# Altium schematic sheet [05] - ENERGY STORAGE AND PROTECTION.SchDoc
size A4; DocumentNumber: 5; SheetNumber: 5; SheetTotal: 12; PageSetup: Record=PageOptions|CenterHorizontal=True|CenterVertical=True|PrintScale=0.73|XCorrection=1.00|YCorrection=1.00|PrintKind=0|BorderSize=5000000|LeftOffset=0|BottomOffset=0|Orientation=2|PaperLength=1000|PaperWidth=1000|Scale=100|PaperSource=7|PrintQuality=-3|MediaType=1|DitherType=10|PrintScaleMode=1|PaperKind=A3|PaperIndex=8
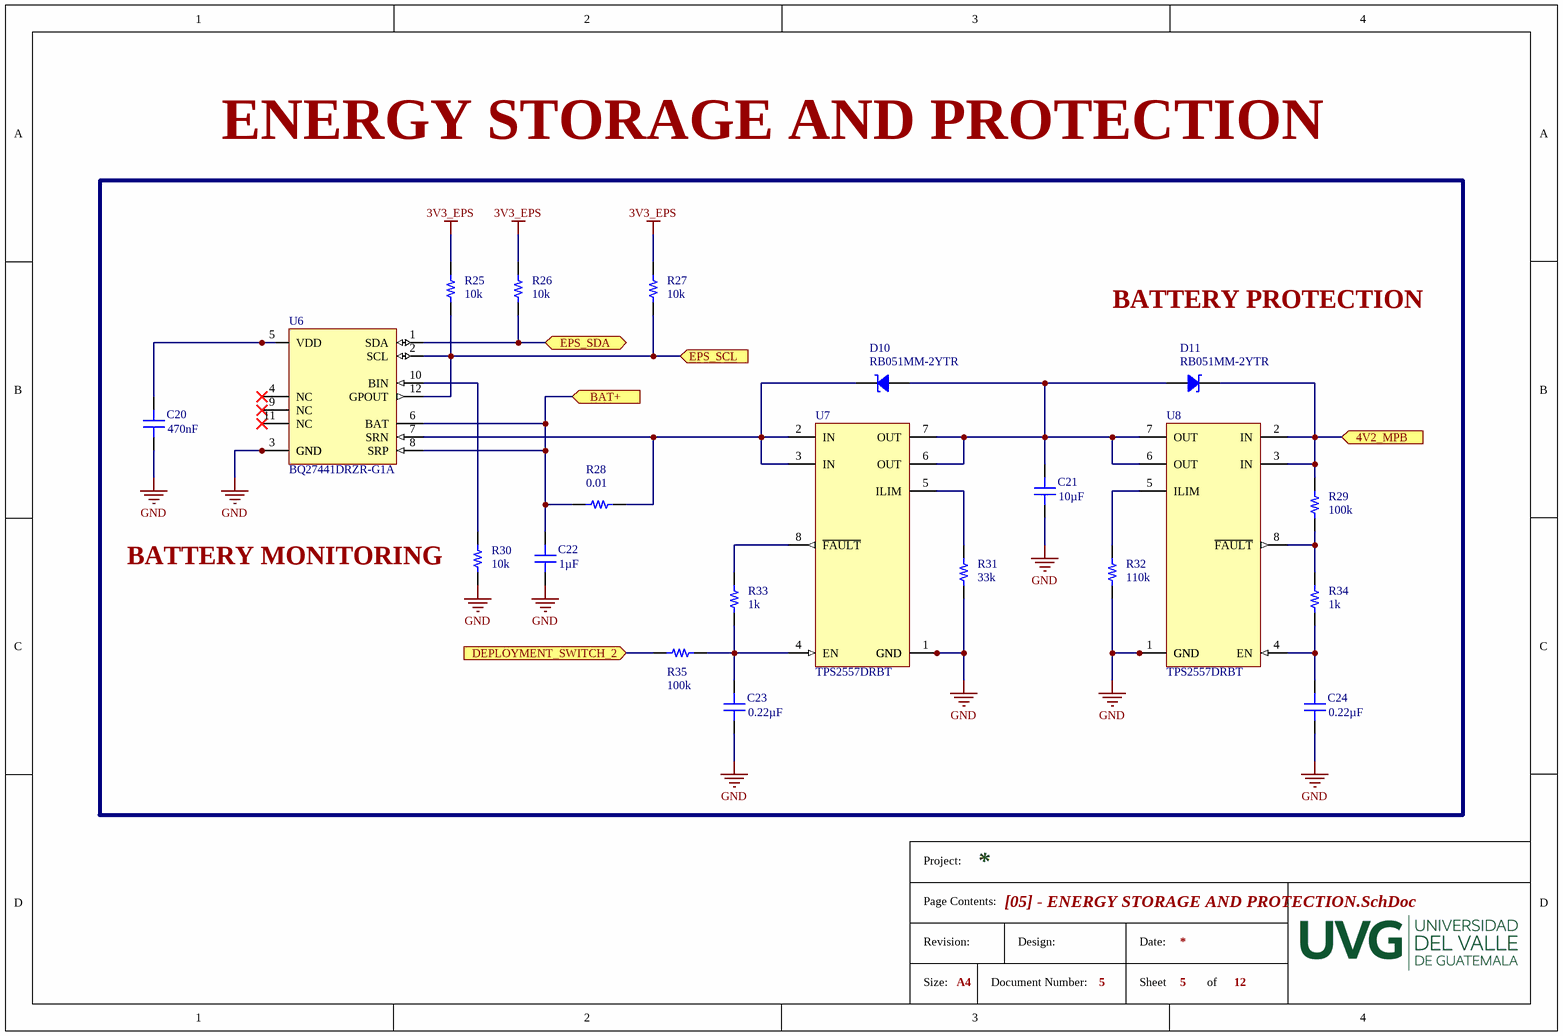
[diagram p0: [05] - ENERGY STORAGE AND PROTECTION.SchDoc]

## Parts
C20  Capacitance: 470nF  [RES 0603/1608]  (hidden comment: CL10B474KA8NFNC)
C21  Capacitance: 10µF  [CAP 0603/1608]  (hidden comment: CL10A106MQ8NNNC)
C22  Capacitance: 1µF  [CAP 0603/1608]  (hidden comment: CL10A105KP8NNNC)
C23  EMK107B7224KA-T  [CAP 0603/1608]  (value not drawn)
C24  EMK107B7224KA-T  [CAP 0603/1608]  (value not drawn)
D10  RB051MM-2YTR  [SOD123F]
D11  RB051MM-2YTR  [SOD123F]
R25  Resistance: 10k  [RES 0603/1608]  (hidden comment: RNCP0603FTD10K0)
R26  Resistance: 10k  [RES 0603/1608]  (hidden comment: RNCP0603FTD10K0)
R27  Resistance: 10k  [RES 0603/1608]  (hidden comment: RNCP0603FTD10K0)
R28  Resistance: 0.01  [STACKPOLE CSR2010]  (hidden comment: CSRN2010FK10L0)
R29  Resistance: 100k  [RES 0603/1608]  (hidden comment: CR0603-JW-104ELF)
R30  Resistance: 10k  [RES 0603/1608]  (hidden comment: RNCP0603FTD10K0)
R31  CRGCQ0603F33K  [RES 0603/1608]  (value not drawn)
R32  Resistance: 110k  [RES 0603/1608]  (hidden comment: RC0603FR-07110KL)
R33  Resistance: 1k  [RES 0603/1608]  (hidden comment: ESR03EZPJ102)
R34  Resistance: 1k  [RES 0603/1608]  (hidden comment: ESR03EZPJ102)
R35  Resistance: 100k  [RES 0603/1608]  (hidden comment: CR0603-JW-104ELF)
U6  BQ27441DRZR-G1A  [12-VFDFN]
U7  TPS2557DRBT  [8-VDFN]
U8  TPS2557DRBT  [8-VDFN]

## Ports
4V2_MPB (in), BAT+ (in), DEPLOYMENT_SWITCH_2 (in), EPS_SCL (in), EPS_SDA (bidir)

## Nets
3V3_EPS: R25.2 R26.2 R27.2
GND: C20.1 C21.1 C22.1 C23.1 C24.1 R30.1 R31.1 R32.1 U6.3(GND) U6.13(GND) U7.1(GND) U7.9(GND) U8.1(GND) U8.9(GND)
4V2_MPB: D11.2 R29.2 U8.2(IN) U8.3(IN) ; port 4V2_MPB
BAT+: C22.2 R28.2 U6.6(BAT) U6.8(SRP) ; port BAT+
DEPLOYMENT_SWITCH_2: R35.1 ; port DEPLOYMENT_SWITCH_2
EPS_SCL: R25.1 R27.1 U6.2(SCL) U6.12(GPOUT) ; port EPS_SCL
EPS_SDA: R26.1 U6.1(SDA) ; port EPS_SDA
NetC20_2: C20.2 U6.5(VDD)
NetC21_2: C21.2 D10.1 D11.1 U7.6(OUT) U7.7(OUT) U8.6(OUT) U8.7(OUT)
NetC23_2: C23.2 R33.1 R35.2 U7.4(EN)
NetC24_2: C24.2 R34.1 U8.4(EN)
NetD10_2: D10.2 R28.1 U6.7(SRN) U7.2(IN) U7.3(IN)
NetR29_1: R29.1 R34.2 U8.8(~{FAULT})
NetR30_2: R30.2 U6.10(BIN)
NetR31_2: R31.2 U7.5(ILIM)
NetR32_2: R32.2 U8.5(ILIM)
NetR33_2: R33.2 U7.8(~{FAULT})

Not connected (* = marked no-connect by the designer): U6 4(NC)* 9(NC)* 11(NC)*

## Notes on the sheet
- ENERGY STORAGE AND PROTECTION
- BATTERY PROTECTION
- BATTERY MONITORING
- (near R31) 33k
- (near C23) 0.22µF
- (near C24) 0.22µF
- Project:
- Page Contents:
- Size:
- Revision:
- A4
- Document Number:
- Design:
- Date:
- Sheet
- of

## Library data of the parts
C20 = CL10B474KA8NFNC: CAP CER 0.47UF 25V X7R 0603; Manufacturer: Samsung; Tolerance: 10%; Supplier 1: Digi-Key; Manufacturer Part Number: CL10B474KA8NFNC; Stock 1: 469116; Pricing 1: 1 = 0.10000, 10 = 0.07300, 100 = 0.03450, 500 = 0.02422, 1000 = 0.02005 (USD); RoHS: Yes; Mount: Surface Mount; Case/Package: 0603; Case Code (Metric): 1608; Case Code (Imperial): 0603; Min Operating Temperature: -55°C; Max Operating Temperature: 125°C; Package Quantity: 1; Packaging: Tape and Reel; Voltage Rating: 25V; Dielectric: X7R; Length: 0.063inch; Height: 0.8mm; Width: 0.031inch; Thickness: 0.035inch; Depth: 0.8mm; Radiation Hardening: No; Lead Free: Lead Free; ComponentLink1URL: https://datasheet.ciiva.com/25777/cl10b474ka8nfnc-25777510.pdf?src-supplier=Digi-Key; ComponentLink1Description: https://datasheet.ciiva.com/25777/cl10b474ka8nfnc-25777510.pdf?src-supplier=Digi-Key; ComponentLink2URL: https://datasheet.ciiva.com/16428/cl10b474ka8nfnc-16428839.pdf?src-supplier=Future+Electronics; ComponentLink2Description: https://datasheet.ciiva.com/16428/cl10b474ka8nfnc-16428839.pdf?src-supplier=Future+Electronics; Supplier Part Number 1: 1276-2082-1-ND
C21 = CL10A106MQ8NNNC: CAP CER 10UF 6.3V X5R 0603; Manufacturer: Samsung; Tolerance: 20%; Supplier 1: Digi-Key; Manufacturer Part Number: CL10A106MQ8NNNC; Stock 1: 3866590; Pricing 1: 1 = 0.15000, 10 = 0.11000, 100 = 0.05150, 500 = 0.03614, 1000 = 0.02992 (USD); RoHS: Yes; Mount: Surface Mount; Case/Package: 0603; Case Code (Metric): 1608; Case Code (Imperial): 0603; Contact Plating: Tin; Min Operating Temperature: -55°C; Max Operating Temperature: 85°C; Package Quantity: 1; Packaging: Tape and Reel; Voltage Rating: 6.3V; Dielectric: X5R; Voltage: 6.3V; Length: 1.6mm; Height: 0.8mm; Width: 0.031inch; Thickness: 0.035inch; Depth: 0.8mm; Radiation Hardening: No; ComponentLink1URL: https://datasheet.ciiva.com/25798/cl10a106mq8nnnc-25798320.pdf?src-supplier=Digi-Key; ComponentLink1Description: https://datasheet.ciiva.com/25798/cl10a106mq8nnnc-25798320.pdf?src-supplier=Digi-Key; ComponentLink2URL: https://datasheet.ciiva.com/26838/getdatasheetpartid-357557-26838347.pdf?src-supplier=Verical; ComponentLink2Description: https://datasheet.ciiva.com/26838/getdatasheetpartid-357557-26838347.pdf?src-supplier=Verical; ComponentLink3URL: https://datasheet.ciiva.com/16437/cl05b104kq5nnnc-16437327.pdf?src-supplier=Future+Electronics; ComponentLink3Description: https://datasheet.ciiva.com/16437/cl05b104kq5nnnc-16437327.pdf?src-supplier=Future+Electronics; Supplier Part Number 1: 1276-1119-1-ND
C22 = CL10A105KP8NNNC: CAP CER 1UF 10V X5R 0603; Manufacturer: Samsung; Tolerance: 10%; Supplier 1: Digi-Key; Manufacturer Part Number: CL10A105KP8NNNC; Stock 1: 4411775; Pricing 1: 1 = 0.10000, 10 = 0.03800, 100 = 0.01680, 500 = 0.01200, 1000 = 0.00943 (USD); RoHS: Yes; Mount: Surface Mount; Case/Package: 0603; Case Code (Metric): 1608; Case Code (Imperial): 0603; Contact Plating: Tin; Min Operating Temperature: -55°C; Max Operating Temperature: 85°C; Packaging: Tape and Reel; Package Quantity: 1; Voltage Rating: 10V; Dielectric: X5R; Voltage: 10V; Length: 1.6mm; Height: 0.8mm; Width: 0.031inch; Thickness: 0.035inch; Depth: 0.8mm; Radiation Hardening: No; ComponentLink1URL: https://datasheet.ciiva.com/15195/getdatasheetpartid-358616-15195708.pdf?src-supplier=Verical; ComponentLink1Description: https://datasheet.ciiva.com/15195/getdatasheetpartid-358616-15195708.pdf?src-supplier=Verical; ComponentLink2URL: https://datasheet.ciiva.com/16358/cl05b104kq5nnnc-16358431.pdf?src-supplier=Future+Electronics; ComponentLink2Description: https://datasheet.ciiva.com/16358/cl05b104kq5nnnc-16358431.pdf?src-supplier=Future+Electronics; Supplier Part Number 1: 1276-1182-1-ND
C23 C24 = EMK107B7224KA-T: CAP CER 0.22UF 16V X7R 0603
D10 D11 = RB051MM-2YTR: DIODE SCHOTTKY 20V 3A PMDU; Manufacturer: Rohm; Supplier 1: Digi-Key; Manufacturer Part Number: RB051MM-2YTR; Stock 1: 1333; Pricing 1: 1 = 0.49000, 10 = 0.41700, 100 = 0.31150, 500 = 0.24472, 1000 = 0.18911 (USD); Mount: Surface Mount; Packaging: Tape and Reel; Average Rectified Current: 3A; Max Reverse Voltage (DC): 20V; ComponentLink1URL: http://www.mouser.com/ds/2/348/rb051mm-2y-e-1017157.pdf?src-supplier=Mouser; ComponentLink1Description: http://www.mouser.com/ds/2/348/rb051mm-2y-e-1017157.pdf?src-supplier=Mouser; ComponentLink2URL: http://www.rohm.com/web/global/datasheet/RB051MM-2Y/rb051mm-2y-e?src-supplier=Digi-Key; ComponentLink2Description: http://www.rohm.com/web/global/datasheet/RB051MM-2Y/rb051mm-2y-e?src-supplier=Digi-Key; ComponentLink3URL: http://rohmfs.rohm.com/en/techdata_basic/diode/taping/Taping_PMDU(M)_TR-e.pdf?src-supplier=Digi-Key; ComponentLink3Description: http://rohmfs.rohm.com/en/techdata_basic/diode/taping/Taping_PMDU(M)_TR-e.pdf?src-supplier=Digi-Key; Supplier Part Number 1: RB051MM-2YCT-ND
R25-R27 R30 = RNCP0603FTD10K0: RES SMD 10K OHM 1% 1/8W 0603; Manufacturer: Stackpole Electronics; Max Power Dissipation: 125mW; Temperature Coefficient: 100ppm/°C; Supplier 1: Digi-Key; Manufacturer Part Number: RNCP0603FTD10K0; Stock 1: 579582; Pricing 1: 1 = 0.10000, 10 = 0.06700, 100 = 0.02730, 1000 = 0.01224, 2500 = 0.01063 (USD); RoHS: Yes; Mount: Surface Mount; Case/Package: 0603; Case Code (Metric): 1608; Case Code (Imperial): 0603; Contact Plating: Tin; Min Operating Temperature: -55°C; Max Operating Temperature: 155°C; Packaging: Tape and Reel; Tolerance: 1%; Composition: Thin Film; Number of Terminations: 2; Features: Moisture Resistant; Length: 0.059inch; Height: 0.02inch; Width: 0.031inch; Radiation Hardening: No; Lead Free: Lead Free; ComponentLink1URL: https://www.seielect.com/Catalog/SEI-rncp.pdf?src-supplier=Avnet; ComponentLink1Description: https://www.seielect.com/Catalog/SEI-rncp.pdf?src-supplier=Avnet; ComponentLink2URL: https://www.seielect.com/catalog/SEI-Packaging.pdf?src-supplier=Digi-Key; ComponentLink2Description: https://www.seielect.com/catalog/SEI-Packaging.pdf?src-supplier=Digi-Key; ComponentLink3URL: https://www.seielect.com/Catalog/SEI-rncp.pdf?src-supplier=Digi-Key; ComponentLink3Description: https://www.seielect.com/Catalog/SEI-rncp.pdf?src-supplier=Digi-Key; Supplier Part Number 1: RNCP0603FTD10K0CT-ND
R28 = CSRN2010FK10L0: RES 0.01 OHM 1% 1W 2010; Manufacturer: Stackpole Electronics; Temperature Coefficient: 250ppm/°C; Supplier 1: Digi-Key; Manufacturer Part Number: CSRN2010FK10L0; Stock 1: 15344; Pricing 1: 1=0.58, 10=0.485, 25=0.416, 50=0.3742, 100=0.3257, 250=0.29108, 500=0.23562 (USD); Mount: Surface Mount; Case/Package: 2010; Case Code (Metric): 5025; Case Code (Imperial): 2010; Contact Plating: Matte,Tin; Min Operating Temperature: -55°C; Max Operating Temperature: 155°C; Packaging: Tape and Reel; Tolerance: 1%; Power Rating: 1W; Composition: Thick Film; Number of Terminations: 2; Max Power Dissipation: 1W; Length: 0.197inch; Height: 0.03inch; Width: 0.097inch; Radiation Hardening: No; Supplier Part Number 1: CSRN2010FK10L0DKR-ND
R29 R35 = CR0603-JW-104ELF: RES SMD 100K OHM 5% 1/10W 0603; Manufacturer: Bourns; Power Rating: 100mW; Voltage Rating: 50V; Temperature Coefficient: 200ppm/°C; Supplier 1: Digi-Key; Manufacturer Part Number: CR0603-JW-104ELF; Stock 1: 138181; Pricing 1: 1 = 0.10000, 10 = 0.01500, 25 = 0.01080, 50 = 0.00840, 100 = 0.00610, 250 = 0.00468, 500 = 0.00374, 1000 = 0.00275 (USD); RoHS: Yes; Mount: Surface Mount; Case/Package: 0603; Number of Pins: 2; Case Code (Imperial): 0603; Case Code (Metric): 1608; Contact Plating: Tin; Min Operating Temperature: -55°C; Max Operating Temperature: 155°C; Packaging: Tape and Reel; Tolerance: 5%; Package Quantity: 5000; Composition: Thick Film; Termination: SMD/SMT; Working Voltage: 50V; Military Standard: Not; Voltage Rating (DC): 50V; Length: 1.6mm; Height: 0.45mm; Width: 0.8mm; Depth: 0.8mm; Thickness: 457um; Radiation Hardening: No; REACH SVHC: No SVHC; ComponentLink1URL: https://datasheet.ciiva.com/22713/691949-22713239.pdf?src-supplier=Element14; ComponentLink1Description: https://datasheet.ciiva.com/22713/691949-22713239.pdf?src-supplier=Element14; ComponentLink2URL: https://datasheet.ciiva.com/23776/1902866-23776391.pdf?src-supplier=Newark; ComponentLink2Description: https://datasheet.ciiva.com/23776/1902866-23776391.pdf?src-supplier=Newark; ComponentLink3URL: https://datasheet.ciiva.com/16766/70154685-16766760.pdf?src-supplier=Allied+Electronics; ComponentLink3Description: https://datasheet.ciiva.com/16766/70154685-16766760.pdf?src-supplier=Allied+Electronics; ComponentLink4URL: https://datasheet.ciiva.com/30229/159chpreztr-30229129.pdf?src-supplier=Onlinecomponents.com; ComponentLink4Description: https://datasheet.ciiva.com/30229/159chpreztr-30229129.pdf?src-supplier=Onlinecomponents.com; ComponentLink5URL: https://datasheet.ciiva.com/16935/chpreztr-16935963.pdf?src-supplier=Avnet+Europe; ComponentLink5Description: https://datasheet.ciiva.com/16935/chpreztr-16935963.pdf?src-supplier=Avnet+Europe; ComponentLink6URL: https://datasheet.ciiva.com/5543/chpreztr-5543676.pdf?src-supplier=Mouser; ComponentLink6Description: https://datasheet.ciiva.com/5543/chpreztr-5543676.pdf?src-supplier=Mouser; ComponentLink7URL: https://datasheet.ciiva.com/9120/chpreztr-9120764.pdf?src-supplier=Avnet; ComponentLink7Description: https://datasheet.ciiva.com/9120/chpreztr-9120764.pdf?src-supplier=Avnet; ComponentLink8URL: https://datasheet.ciiva.com/46383/1791942-46383790.pdf?src-supplier=Element14; ComponentLink8Description: https://datasheet.ciiva.com/46383/1791942-46383790.pdf?src-supplier=Element14; ComponentLink9URL: https://datasheet.ciiva.com/48692/001055501-da-01-en-smd-wid-cr0603-jw-104elf-100k-ohm-1-10w-48692133.pdf?src-supplier=Conrad; ComponentLink9Description: https://datasheet.ciiva.com/48692/001055501-da-01-en-smd-wid-cr0603-jw-104elf-100k-ohm-1-10w-48692133.pdf?src-supplier=Conrad; Supplier Part Number 1: CR0603-JW-104ELFCT-ND
R31 = CRGCQ0603F33K: RES SMD 33K OHM 1% 1/10W 0603; Manufacturer: TE Connectivity; Supplier 1: Digi-Key; Manufacturer Part Number: CRGCQ0603F33K; Stock 1: 142729; Pricing 1: 1 = 0.10000, 10 = 0.03100, 100 = 0.01260, 1000 = 0.00568, 2500 = 0.00493 (USD); ComponentLink1URL: http://sigma.octopart.com/114683329/technical_drawing/TE-Connectivity-CRGCQ0603F33K.pdf?src-supplier=TE+Connectivity; ComponentLink1Description: http://sigma.octopart.com/114683329/technical_drawing/TE-Connectivity-CRGCQ0603F33K.pdf?src-supplier=TE+Connectivity; ComponentLink2URL: http://datasheet.octopart.com/CRGCQ0603F33K-TE-Connectivity-datasheet-114679081.pdf?src-supplier=TE+Connectivity; ComponentLink2Description: http://datasheet.octopart.com/CRGCQ0603F33K-TE-Connectivity-datasheet-114679081.pdf?src-supplier=TE+Connectivity; Supplier Part Number 1: A129706CT-ND
R32 = RC0603FR-07110KL: RES SMD 110K OHM 1% 1/10W 0603; Manufacturer: Yageo; Power Rating: 100mW; Voltage Rating: 50V; Temperature Coefficient: 100ppm/°C; Supplier 1: Digi-Key; Manufacturer Part Number: RC0603FR-07110KL; Stock 1: 1846762; Pricing 1: 1=0.1, 10=0.024, 100=0.0097, 1000=0.00437, 2500=0.00379 (USD); Mount: Surface Mount; Case/Package: 0603; Case Code (Metric): 1608; Case Code (Imperial): 0603; Min Operating Temperature: -55°C; Max Operating Temperature: 155°C; Tolerance: 1%; Package Quantity: 1; Packaging: Tape and Reel; Composition: Thick Film; Number of Terminations: 2; Termination: SMD/SMT; Military Standard: Not; Max Power Dissipation: 100mW; Voltage Rating (DC): 50V; Features: Moisture Resistant; Length: 1.6mm; Height: 0.022inch; Width: 0.031inch; Depth: 0.8mm; Lead Free: Lead Free; ComponentLink1URL: http://documents.rs-components.com/techlib://itc_doclist_GB.htm?stockno=5049117&src-supplier=RSComponents; ComponentLink1Description: http://documents.rs-components.com/techlib://itc_doclist_GB.htm?stockno=5049117&src-supplier=RSComponents; ComponentLink2URL: http://www.yageo.com/documents/recent/PYu-RC_Group_51_RoHS_L_10.pdf?src-supplier=Digi-Key; ComponentLink2Description: http://www.yageo.com/documents/recent/PYu-RC_Group_51_RoHS_L_10.pdf?src-supplier=Digi-Key; ComponentLink3URL: https://www.verical.com/server-webapp/html/getDatasheet?partID=324995&src-supplier=Verical; ComponentLink3Description: https://www.verical.com/server-webapp/html/getDatasheet?partID=324995&src-supplier=Verical; ComponentLink4URL: http://www.yageo.com/documents/recent/PYu-RC_Group_51_RoHS_L_9.pdf?src-supplier=Digi-Key; ComponentLink4Description: http://www.yageo.com/documents/recent/PYu-RC_Group_51_RoHS_L_9.pdf?src-supplier=Digi-Key; Supplier Part Number 1: 311-110KHRCT-ND
R33 R34 = ESR03EZPJ102: RES SMD 1K OHM 5% 1/4W 0603; Manufacturer: Rohm; Temperature Coefficient: 200ppm/°C; Max Power Dissipation: 250mW; Supplier 1: Digi-Key; Manufacturer Part Number: ESR03EZPJ102; Stock 1: 187581; Pricing 1: 1 = 0.10000, 10 = 0.08300, 100 = 0.03180, 1000 = 0.01398, 2500 = 0.01207 (USD); RoHS: Yes; Case/Package: 0603; Case Code (Metric): 1608; Case Code (Imperial): 0603; Min Operating Temperature: -55°C; Max Operating Temperature: 155°C; Tolerance: 5%; Package Quantity: 1; Packaging: Tape and Reel; Composition: Thick Film; Number of Terminations: 2; Features: Automotive AEC-Q200; Length: 0.063inch; Height: 0.022inch; Width: 0.031inch; Lead Free: Lead Free; ComponentLink1URL: https://datasheet.ciiva.com/2469/esr-2469603.pdf?src-supplier=Digi-Key; ComponentLink1Description: https://datasheet.ciiva.com/2469/esr-2469603.pdf?src-supplier=Digi-Key; ComponentLink2URL: https://datasheet.ciiva.com/2469/esr-2469604.pdf?src-supplier=Digi-Key; ComponentLink2Description: https://datasheet.ciiva.com/2469/esr-2469604.pdf?src-supplier=Digi-Key; ComponentLink3URL: https://datasheet.ciiva.com/2469/esr-2469605.pdf?src-supplier=Digi-Key; ComponentLink3Description: https://datasheet.ciiva.com/2469/esr-2469605.pdf?src-supplier=Digi-Key; Supplier Part Number 1: RHM1.0KDCT-ND
U6 = BQ27441DRZR-G1A: IC BATT FUEL GAUGE LI-ION 12SON; Manufacturer: Texas Instruments; Number of Cells: 1; Interface: I2C; Capacity: 8000mAh; Output Voltage: 600mV; Output Current: 500uA; Operating Supply Voltage: 4.5V; Supplier 1: Digi-Key; Manufacturer Part Number: BQ27441DRZR-G1A; Stock 1: 11262; Pricing 1: 1=2.62, 10=2.353, 100=1.8911, 500=1.55376, 1000=1.2874 (USD); Mount: Surface Mount; Case/Package: QFN; Number of Pins: 12; Contact Plating: Gold; Min Operating Temperature: -40°C; Max Operating Temperature: 85°C; Package Quantity: 3000; Packaging: Tape and Reel; Lead Free: Lead Free; Supplier Part Number 1: 296-39941-6-ND
U7 U8 = TPS2557DRBT: IC PWR DIST SWITCH ADJ 8SON; Manufacturer: Texas Instruments; Number of Inputs: 1; Max Output Current: 5A; Max Input Voltage: 6.5V; Min Input Voltage: 2.5V; Interface: On/Off; On-State Resistance: 22mR; Turn-Off Delay Time: 6ms; Turn-On Delay Time: 9ms; Power Rating: 2.403W; Power Dissipation: 2.4W; Fault Protection: Over Temperature; Output Configuration: High Side; Supplier 1: Digi-Key; Manufacturer Part Number: TPS2557DRBT; Stock 1: 20726; Pricing 1: 1 = 2.46000, 10 = 2.21100, 100 = 1.77710 (USD); RoHS: Yes; Mount: Surface Mount; Number of Pins: 8; Weight: 0.000847oz; Contact Plating: Gold; Min Operating Temperature: -40°C; Max Operating Temperature: 85°C; Number of Outputs: 1; Packaging: Tape and Reel; Output Current: 5A; Min Supply Voltage: 2.5V; Max Supply Voltage: 6.5V; Package Quantity: 250; Voltage: 6.5V; Current: 5A; Max Power Dissipation: 2.403W; Termination: SMD/SMT; Length: 3.15mm; Height: 0.95mm; Width: 3.15mm; Radiation Hardening: No; REACH SVHC: No SVHC; Lead Free: Lead Free; ComponentLink1URL: https://datasheet.ciiva.com/1572/1788976-1572611.pdf?src-supplier=Digi-Key; ComponentLink1Description: https://datasheet.ciiva.com/1572/1788976-1572611.pdf?src-supplier=Digi-Key; ComponentLink2URL: https://datasheet.ciiva.com/1572/1633920-1572613.pdf?src-supplier=Farnell; ComponentLink2Description: https://datasheet.ciiva.com/1572/1633920-1572613.pdf?src-supplier=Farnell; ComponentLink3URL: https://datasheet.ciiva.com/15113/getdatasheetpartid-224110-15113913.pdf?src-supplier=Verical; ComponentLink3Description: https://datasheet.ciiva.com/15113/getdatasheetpartid-224110-15113913.pdf?src-supplier=Verical; ComponentLink4URL: https://datasheet.ciiva.com/41462/001014733-da-01-en-ic-pwr-dist-switc-tps2557drbt-vson-8-tid-41462584.pdf?src-supplier=Conrad; ComponentLink4Description: https://datasheet.ciiva.com/41462/001014733-da-01-en-ic-pwr-dist-switc-tps2557drbt-vson-8-tid-41462584.pdf?src-supplier=Conrad; ComponentLink5URL: https://datasheet.ciiva.com/26882/tps2557drbt-26882159.pdf?src-supplier=IIIC; ComponentLink5Description: https://datasheet.ciiva.com/26882/tps2557drbt-26882159.pdf?src-supplier=IIIC; ComponentLink6URL: https://datasheet.ciiva.com/1963/tps2557-1963969.pdf?src-supplier=Digi-Key; ComponentLink6Description: https://datasheet.ciiva.com/1963/tps2557-1963969.pdf?src-supplier=Digi-Key; ComponentLink7URL: https://datasheet.ciiva.com/1963/tps2557-1963970.pdf?src-supplier=Digi-Key; ComponentLink7Description: https://datasheet.ciiva.com/1963/tps2557-1963970.pdf?src-supplier=Digi-Key; ComponentLink8URL: https://datasheet.ciiva.com/3216/tps2556-3216885.pdf?src-supplier=Avnet; ComponentLink8Description: https://datasheet.ciiva.com/3216/tps2556-3216885.pdf?src-supplier=Avnet; ComponentLink9URL: https://datasheet.ciiva.com/1512/1788976-1512726.pdf?src-supplier=Element14; ComponentLink9Description: https://datasheet.ciiva.com/1512/1788976-1512726.pdf?src-supplier=Element14; ComponentLink10URL: https://datasheet.ciiva.com/3217/tps2556-3217144.pdf?src-supplier=Avnet; ComponentLink10Description: https://datasheet.ciiva.com/3217/tps2556-3217144.pdf?src-supplier=Avnet; ComponentLink11URL: https://datasheet.ciiva.com/14153/tps2556-2557-eng-ds-14153308.pdf?src-supplier=Distrelec; ComponentLink11Description: https://datasheet.ciiva.com/14153/tps2556-2557-eng-ds-14153308.pdf?src-supplier=Distrelec; ComponentLink12URL: https://datasheet.ciiva.com/26182/tps2556-26182925.pdf?src-supplier=Avnet+Europe; ComponentLink12Description: https://datasheet.ciiva.com/26182/tps2556-26182925.pdf?src-supplier=Avnet+Europe; Supplier Part Number 1: 296-25432-1-ND